# Altium schematic sheet CLOCKING.SchDoc
size A4; SheetNumber: 3; SheetTotal: 4
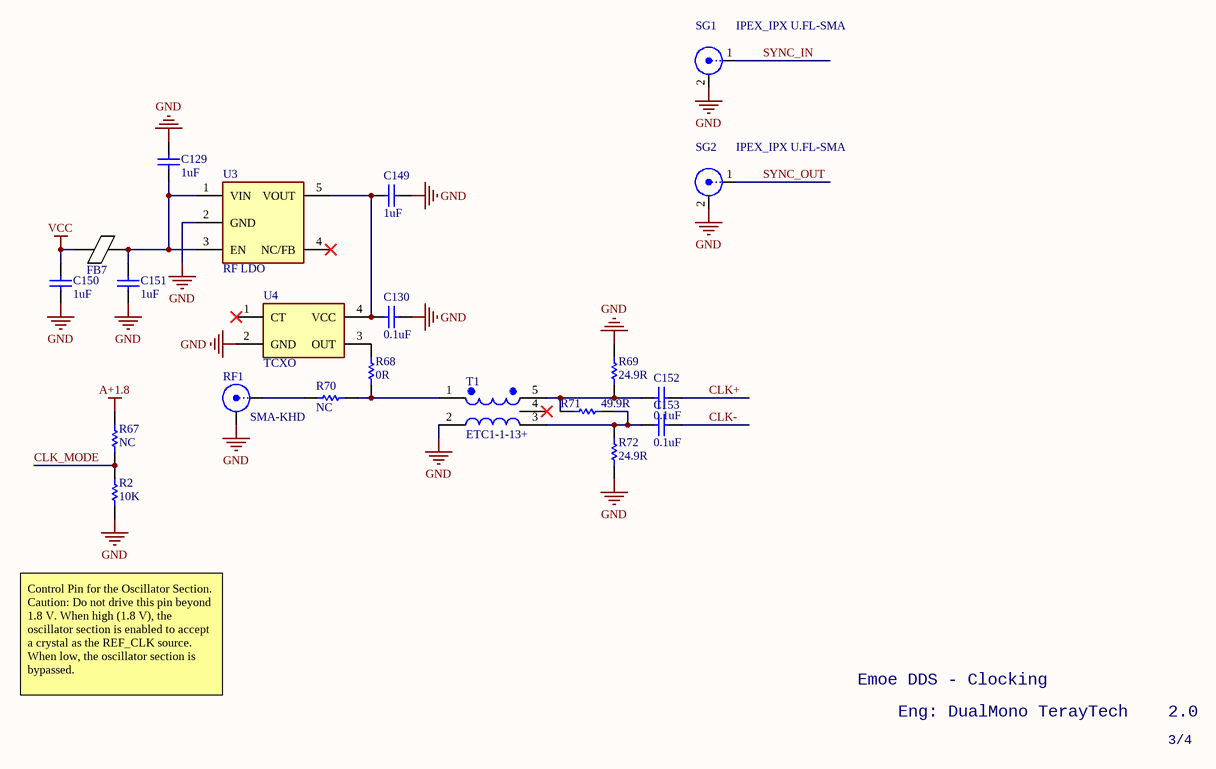
[diagram p0: CLOCKING.SchDoc]

## Parts
C129  1uF  [0603_C]
C130  0.1uF  [0402]
C149  1uF  [0603_C]
C150  1uF  [0603_C]
C151  1uF  [0603_C]
C152  0.1uF  [0402l]
C153  0.1uF  [0402l]
FB7  600Ω @ 100MHz  [0603]  (value not drawn)
R2  10K  [0402]
R67  NC  [0402L]
R68  0R  [0402]
R69  24.9R  [0402L]
R70  NC  [0402]
R71  49.9R  [0402L]
R72  24.9R  [0402L]
RF1  SMA-KHD  [SMA-5]
SG1  IPEX_IPX U.FL-SMA  [IPEX_gen1]
SG2  IPEX_IPX U.FL-SMA  [IPEX_gen1]
T1  ETC1-1-13+  [BALUN-5]
U3  RF LDO  [SOT-23-5]
U4  TCXO  [OSC_KH3225_4P]

## Nets
A+1.8: R67.1
GND: C129.1 C130.2 C149.1 C150.1 C151.1 R2.2 R69.1 R72.1 RF1.1 SG1.2(GND) SG2.2(GND) T1.2 U3.2(GND) U4.2(GND)
VCC: C150.2 FB7.1
CLK+: C152.2
CLK-: C153.2
CLK_MODE: R2.1 R67.2
SYNC_IN: SG1.1(X)
SYNC_OUT: SG2.1(X)
NetC129_2: C129.2 C151.2 FB7.2 U3.1(VIN) U3.3(EN)
NetC130_1: C130.1 C149.2 U3.5(VOUT) U4.4(VCC)
NetC152_1: C152.1 R69.2 R71.1 T1.5
NetC153_1: C153.1 R71.2 R72.2 T1.3
NetR68_1: R68.1 U4.3(OUT)
NetR68_2: R68.2 R70.2 T1.1
NetR70_1: R70.1 RF1.2

Not connected (* = marked no-connect by the designer): T1 4*; U3 4(NC/FB)*; U4 1(CT)*

## Notes on the sheet
- Emoe DDS - Clocking
- Control Pin for the Oscillator Section. Caution: Do not drive this pin beyond 1.8 V. When high (1.8 V), the oscillator section is enabled to accept a crystal as the REF_CLK source. When low, the oscillator section is bypassed.
- Eng: DualMono TerayTech
- 2.0
- 3/4

## Library data of the parts
C129 C130 C149-C153 = CAP: Capacitor; Value: 104; Published: 8-Jun-2000; LatestRevisionDate: 17-Jul-2002; LatestRevisionNote: Re-released for DXP Platform.; PackageReference: RAD-0.3; Publisher: Altium Limited
FB7 = FB: 磁珠 600Ω @ 100MHz
R2 R67-R72 = RES: Resistor; Value: 1K; Published: 8-Jun-2000; Revision: July-2002: Re-released for DXP Platform.; Publisher: Altium Limited
RF1 = SMA_KHD
T1 = ETC1-1-13
U3 = ADP150